# EAGLE design time_circuits_controller (EAGLE 9.5.1)
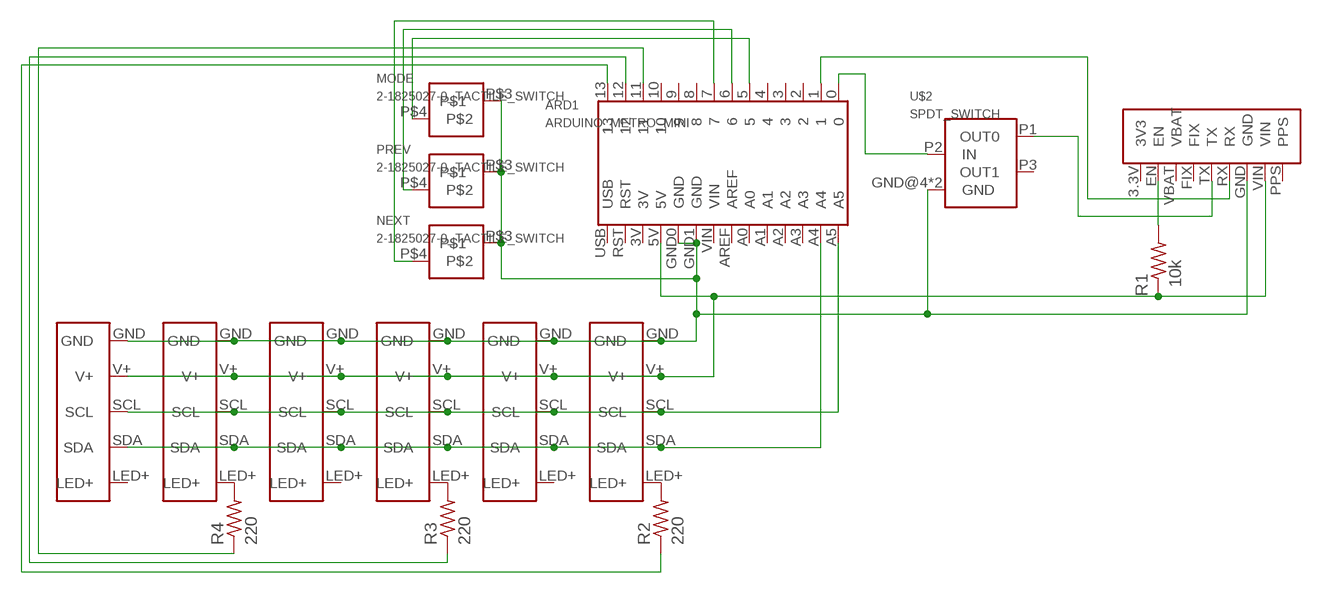
[diagram p0: schematic, sheet 1]

## Parts
ARD1  ARDUINO_METRO_MINI  [ARDUINO_METRO_MINI]
MODE  2-1825027-0_TACTILE_SWITCH  [2-1825027-0_TACTILE_SWITCH]
NEXT  2-1825027-0_TACTILE_SWITCH  [2-1825027-0_TACTILE_SWITCH]
OUTPUT_00  INTERCONNECTOR4  [INTERCONNECTOR4]
OUTPUT_01  INTERCONNECTOR4  [INTERCONNECTOR4]
OUTPUT_10  INTERCONNECTOR4  [INTERCONNECTOR4]
OUTPUT_11  INTERCONNECTOR4  [INTERCONNECTOR4]
OUTPUT_20  INTERCONNECTOR4  [INTERCONNECTOR4]
OUTPUT_21  INTERCONNECTOR4  [INTERCONNECTOR4]
PREV  2-1825027-0_TACTILE_SWITCH  [2-1825027-0_TACTILE_SWITCH]
R1  10k  R-US_0204/7  [0204/7]
R2  220  R-US_0204/7  [0204/7]
R3  220  R-US_0204/7  [0204/7]
R4  220  R-US_0204/7  [0204/7]
U$1  GPSBREAKOUTV3  [GPSBREAKOUTV3]
U$2  SPDT_SWITCH  [SPDT_SWITCH]

## Nets
5V: ARD1.5V OUTPUT_00.V+ OUTPUT_01.V+ OUTPUT_10.V+ OUTPUT_11.V+ OUTPUT_20.V+ OUTPUT_21.V+ R1.1 U$1.VIN
GND: ARD1.GND0(GND) ARD1.GND1(GND) MODE.P$3 NEXT.P$3 OUTPUT_00.GND OUTPUT_01.GND OUTPUT_10.GND OUTPUT_11.GND OUTPUT_20.GND OUTPUT_21.GND PREV.P$3 U$1.GND U$2.GND@4(GND) U$2.GND@5(GND)
N$1: R1.2 U$1.EN
N$2: OUTPUT_21.LED+ R2.2
N$3: OUTPUT_11.LED+ R3.2
N$4: ARD1.1 U$1.RX
N$5: ARD1.5 MODE.P$4
N$6: ARD1.0 U$2.P2(IN)
N$7: ARD1.A5 OUTPUT_00.SCL OUTPUT_01.SCL OUTPUT_10.SCL OUTPUT_11.SCL OUTPUT_20.SCL OUTPUT_21.SCL
N$8: ARD1.A4 OUTPUT_00.SDA OUTPUT_01.SDA OUTPUT_10.SDA OUTPUT_11.SDA OUTPUT_20.SDA OUTPUT_21.SDA
N$9: OUTPUT_01.LED+ R4.2
N$10: ARD1.11 R4.1
N$11: ARD1.12 R3.1
N$12: ARD1.13 R2.1
N$13: U$1.TX U$2.P1(OUT0)
N$14: ARD1.6 PREV.P$4
N$15: ARD1.7 NEXT.P$4
Unconnected: ARD1.2 ARD1.3 ARD1.3V ARD1.4 ARD1.8 ARD1.9 ARD1.10 ARD1.A0 ARD1.A1 ARD1.A2 ARD1.A3 ARD1.AREF ARD1.RST ARD1.USB ARD1.VIN OUTPUT_00.LED+ OUTPUT_10.LED+ OUTPUT_20.LED+ U$1.3.3V(3V3) U$1.FIX U$1.PPS U$1.VBAT U$2.P3(OUT1)

## Library data of the parts
ARD1 = 00RonBarry:ARDUINO_METRO_MINI: Arduino Metro Mini
MODE NEXT PREV = 00RonBarry:2-1825027-0_TACTILE_SWITCH
OUTPUT_00 OUTPUT_01 OUTPUT_10 OUTPUT_11 OUTPUT_20 OUTPUT_21 = 00RonBarry:INTERCONNECTOR4
R1-R4 = rcl:R-US_: RESISTOR, American symbol; SPICEPREFIX: R
U$1 = 00RonBarry:GPSBREAKOUTV3
U$2 = 00RonBarry:SPDT_SWITCH

## Board
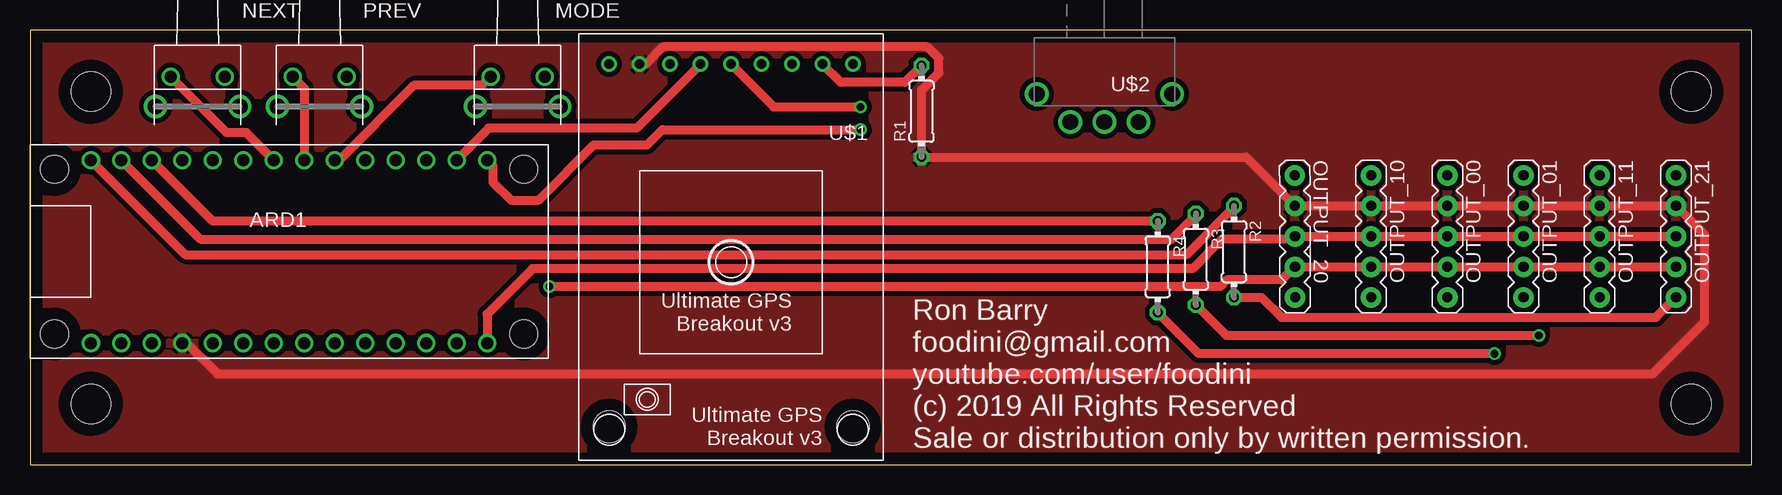
[diagram p1: board, top side]
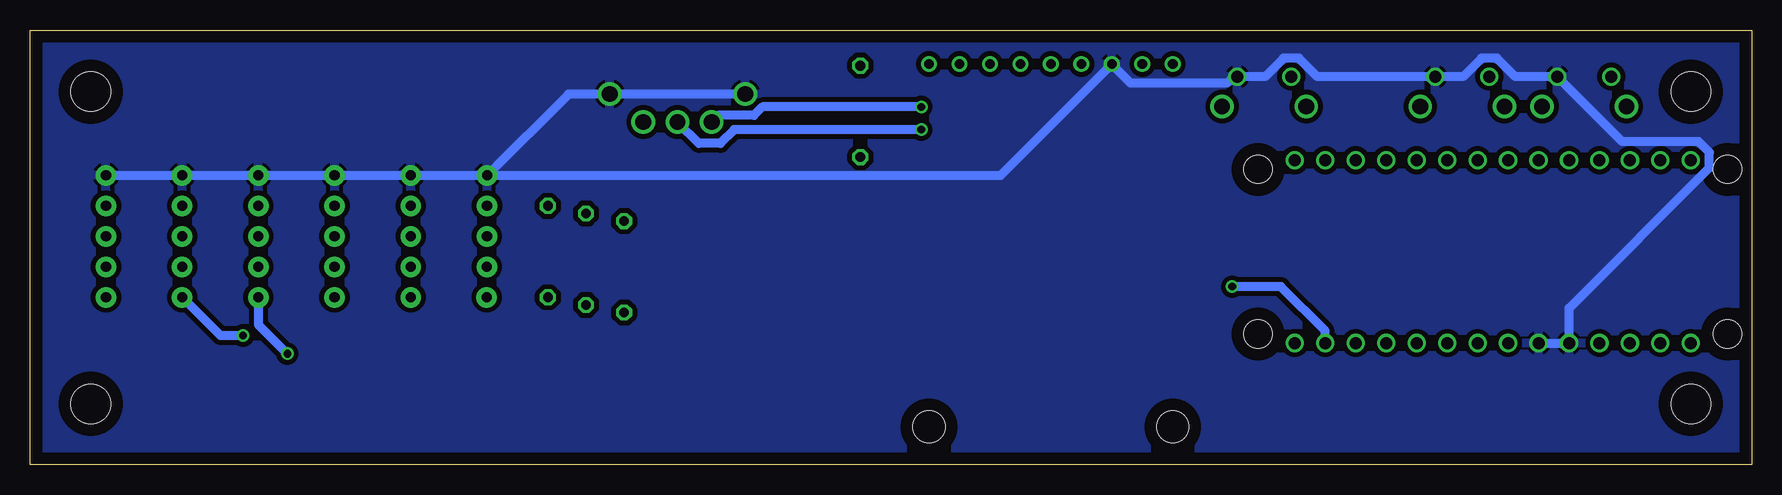
[diagram p2: board, bottom side, seen from below]

Size 143.49 x 36.25 mm. Coordinates in mm from the lower left corner, seen from the top.
Outline: 0,0 143.49,0 143.49,36.25 0,36.25 0,0
Copper layers (1*16): Top 0.035mm / dielectric 1.5mm / Bottom 0.035mm
Design rules "default *": minimum track width 30mil, minimum drill 0.35mm, track to track 16mil, track to pad 16mil, pad to pad 16mil, via to via 16mil, smd to smd 16mil, copper to edge 40mil, drill to drill 6mil, minimum pad ring 10mil, minimum via ring 8mil, stop-mask expansion 4mil, vias tented up to drill 0mil, thermal gap 10mil
Holes 3.3 mm at 5.08,5.08 5.08,31.11 138.43,31.11 138.43,5.08
Holes 2.67 mm at 48.26,3.17 68.58,3.17
Holes 2.34 mm at 41.15,24.64 41.15,10.92 2.03,10.92 2.03,24.64

### Footprints (pad centres in the part's own frame; a part is rotated, then mirrored left to right if it is on the bottom)
ARDUINO_METRO_MINI = drill 1: 0 16.51,7.62; 1 13.97,7.62; 2 11.43,7.62; 3 8.89,7.62; 3V -11.43,-7.62; 4 6.35,7.62; 5 3.81,7.62; 5V -8.89,-7.62; 6 1.27,7.62; 7 -1.27,7.62; 8 -3.81,7.62; 9 -6.35,7.62; 10 -8.89,7.62; 11 -11.43,7.62; 12 -13.97,7.62; 13 -16.51,7.62; A0 3.81,-7.62; A1 6.35,-7.62; A2 8.89,-7.62; A3 11.43,-7.62; A4 13.97,-7.62; A5 16.51,-7.62; AREF 1.27,-7.62; GND0 -6.35,-7.62; GND1 -3.81,-7.62; RST -13.97,-7.62; USB -16.51,-7.62; VIN -1.27,-7.62
2-1825027-0_TACTILE_SWITCH = drill 1.3: P$1 -3.505,1.245; P$2 3.505,1.245 | drill 0.99: P$3 -2.25,-1.245; P$4 2.25,-1.245
INTERCONNECTOR4 = drill 0.85 pad 1.702: GND -3.81,0; LED+ 6.35,0; SCL 1.27,0; SDA 3.81,0; V+ -1.27,0
0204/7 = drill 0.813 octagon: 1 -3.81,0; 2 3.81,0
GPSBREAKOUTV3 = drill 0.8: 3.3V -10.16,0; EN -7.62,0; FIX -2.54,0; GND 5.08,0; PPS 10.16,0; RX 2.54,0; TX 0,0; VBAT -5.08,0; VIN 7.62,0
SPDT_SWITCH = drill 1.321: GND@4 -5.639,-2.337; GND@5 5.639,-2.337; P1 2.845,0; P2 0,0; P3 -2.845,0

### Placement (x,y rotation side)
ARD1  21.59,17.78 0 top
MODE  40.64,31.11 180 top
NEXT  13.97,31.11 180 top
OUTPUT_00  118.11,20.32 270 top
OUTPUT_01  124.46,20.32 270 top
OUTPUT_10  111.76,20.32 270 top
OUTPUT_11  130.81,20.32 270 top
OUTPUT_20  105.41,20.32 270.2 top
OUTPUT_21  137.16,20.32 270 top
PREV  24.13,31.11 180 top
R1  74.3,29.46 90 top
R2  100.33,17.78 270 top
R3  97.16,17.14 270 top
R4  93.98,16.51 270 top
U$1  58.42,33.4 180 top
U$2  89.53,28.57 180 top

### Tracks (layer width: path | path; a pad name or v marks a point on that pad's centre or on a via)
5V
  Top 0.762: ARD1.5V 13.06,10.16 15.63,7.59 135.21,7.59 139.55,11.94 139.55,19.2 OUTPUT_21.V+ OUTPUT_11.V+ OUTPUT_01.V+ OUTPUT_00.V+ OUTPUT_10.V+ | U$1.VIN 51.3,33.4 52.74,34.84 74.77,34.84 75.74,33.87 75.74,32.67 74.3,31.23 R1.1 101.34,25.65 OUTPUT_20.V+ | OUTPUT_20.V+ | OUTPUT_20.V+ OUTPUT_10.V+ | OUTPUT_10.V+
  pour Top: 0,0 0,36.2 143.51,36.2 143.51,0
GND
  Bottom 0.762: ARD1.GND1 ARD1.GND0 15.24,13.06 3.54,24.76 3.54,26.04 4.44,26.94 10.8,26.94 NEXT.P$3 19.71,32.36 21.24,33.9 22.52,33.9 24.05,32.36 PREV.P$3 36.22,32.36 37.75,33.9 39.03,33.9 40.56,32.36 MODE.P$3 43.2,32.36 43.74,31.83 51.77,31.83 U$1.GND 62.61,24.13 OUTPUT_20.GND | OUTPUT_21.GND OUTPUT_11.GND OUTPUT_01.GND OUTPUT_00.GND OUTPUT_10.GND OUTPUT_20.GND | OUTPUT_20.GND | U$2.GND@5 U$2.GND@4 98.61,30.91 OUTPUT_20.GND
  pour Bottom: 0,0 0,36.2 143.51,36.2 143.51,0
N$1
  Top 0.762: R1.2 72.9,31.88 67.56,31.88 U$1.EN
N$2
  Top 0.762: R2.2 102.62,13.97 104.29,12.29 135.48,12.29 OUTPUT_21.LED+
N$3  (via drill 0.64)
  Top 0.762: R3.2 99.69,10.79 v125.73,10.79
  Bottom 0.762: OUTPUT_11.LED+ 127.64,10.79 v125.73,10.79
N$4
  Top 0.762: ARD1.1 38.23,28.07 50.55,28.07 U$1.RX
N$5
  Top 0.762: MODE.P$4 37.66,31.63 31.99,31.63 25.76,25.4 ARD1.5
N$6  (via drill 0.64)
  Top 0.762: ARD1.0 38.58,24.92 38.58,23.57 40.09,22.07 42.39,22.07 46.99,26.67 51.44,26.67 52.7,27.94 v69.22,27.94
  Bottom 0.762: v69.22,27.94 84.81,27.94 85.95,26.8 87.76,26.8 U$2.P2
N$7
  Top 0.762: ARD1.A5 38.1,12.57 41.88,16.36 89,16.36 96.88,16.36 99.31,18.8 105.16,18.8 OUTPUT_20.SCL OUTPUT_10.SCL | OUTPUT_10.SCL | OUTPUT_10.SCL OUTPUT_00.SCL OUTPUT_01.SCL OUTPUT_11.SCL OUTPUT_21.SCL
N$8  (via drill 0.64)
  Top 0.762: v43.31,14.86 99.17,14.86 99.73,15.42 104.33,15.42 OUTPUT_20.SDA OUTPUT_10.SDA | OUTPUT_10.SDA | OUTPUT_10.SDA OUTPUT_00.SDA OUTPUT_01.SDA OUTPUT_11.SDA OUTPUT_21.SDA
  Bottom 0.762: ARD1.A4 35.56,11.18 39.24,14.86 v43.31,14.86
N$9  (via drill 0.64)
  Top 0.762: v122.05,9.27 97.41,9.27 R4.2
  Bottom 0.762: v122.05,9.27 124.46,11.68 OUTPUT_01.LED+
N$10
  Top 0.762: R4.1 15.24,20.32 ARD1.11
N$11
  Top 0.762: R3.1 97.16,20.83 95.15,18.82 14.2,18.82 ARD1.12
N$12
  Top 0.762: ARD1.13 12.95,17.53 96.39,17.53 100.33,21.46 R2.1
N$13  (via drill 0.64)
  Top 0.762: U$1.TX 61.98,29.84 v69.22,29.84
  Bottom 0.762: v69.22,29.84 82.45,29.84 83.16,29.13 86.13,29.13 U$2.P1
N$14
  Top 0.762: PREV.P$4 22.86,31.38 ARD1.6
N$15
  Top 0.762: NEXT.P$4 16.39,27.69 18.03,27.69 ARD1.7

### Text on the board
tPlace: Ron Barry / foodini@gmail.com / youtube.com/user/foodini / (c) 2019 All Rights Reserved / Sale or distribution only by written permission.